# EAGLE design sensor pcb 4 (EAGLE 6.4)
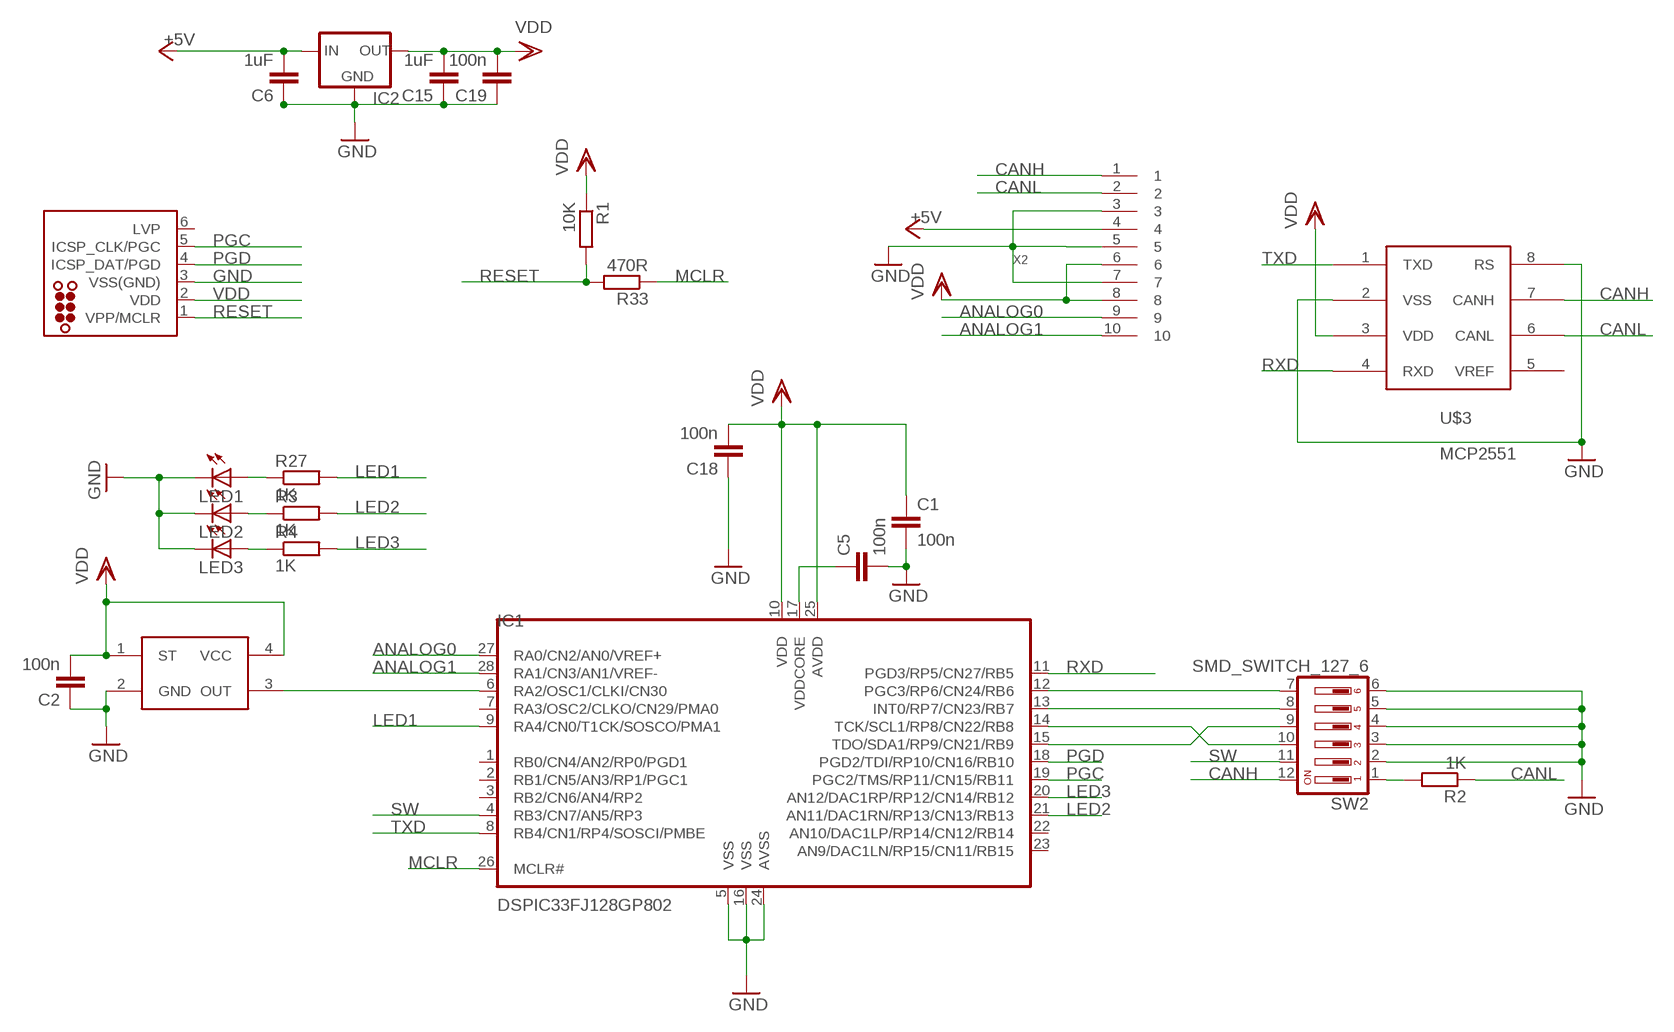
[diagram p0: schematic, sheet 1]

## Parts
C1  100n  C-EUC0402K  [C0402K]
C2  100n  C-EUC0402K  [C0402K]
C5  100n  C-EUC0402K  [C0402K]
C6  1uF  C-EUC0402K  [C0402K]
C15  1uF  C-EUC0402K  [C0402K]
C18  100n  C-EUC0402K  [C0402K]
C19  100n  C-EUC0402K  [C0402K]
IC1  DSPIC33FJ128GP802  [QFN-S28-6X6]
IC2  XC63FPM  [SOT23]
J1  TC2030-MCP-NL  [TC2030-MCP-NL]
LED1  LEDCHIPLED_0603  [CHIPLED_0603]
LED2  LEDCHIPLED_0603  [CHIPLED_0603]
LED3  LEDCHIPLED_0603  [CHIPLED_0603]
R1  10K  R-EU_R0402  [R0402]
R2  1K  R-EU_R0402  [R0402]
R3  1K  R-EU_R0402  [R0402]
R4  1K  R-EU_R0402  [R0402]
R27  1K  R-EU_R0402  [R0402]
R33  470R  R-EU_R0402  [R0402]
SW2  SMD_SWITCH_127_6  [SMD_SWITCH_127_6]
U$1  SG-310  [SG-310]
U$3  MCP2551  [999]
X2  10PINJAS  [10PIN0.1]

## Nets
+5V: C6.2 IC2.3(IN) X2.4
ANALOG0: IC1.27(RA0/CN2/AN0/VREF+) X2.9
ANALOG1: IC1.28(RA1/CN3/AN1/VREF-) X2.10
CANH: SW2.12 U$3.7(CANH) X2.1
CANL: R2.1 U$3.6(CANL) X2.2
GND: C1.2 C2.1 C5.2 C6.1 C15.1 C18.1 C19.1 IC1.5(VSS) IC1.16(VSS) IC1.24(AVSS) IC2.1(GND) J1.3(VSS(GND)) LED1.C LED2.C LED3.C SW2.2 SW2.3 SW2.4 SW2.5 SW2.6 U$1.2(GND) U$3.2(VSS) U$3.8(RS) X2.3 X2.5 X2.7
LED1: IC1.9(RA4/CN0/T1CK/SOSCO/PMA1) R27.2
LED2: IC1.21(AN11/DAC1RN/RP13/CN13/RB13) R3.2
LED3: IC1.20(AN12/DAC1RP/RP12/CN14/RB12) R4.2
MCLR: IC1.26(MCLR#) R33.1
N$1: IC1.12(PGC3/RP6/CN24/RB6) SW2.7
N$2: IC1.13(INT0/RP7/CN23/RB7) SW2.8
N$3: IC1.15(TDO/SDA1/RP9/CN21/RB9) SW2.9
N$4: IC1.14(TCK/SCL1/RP8/CN22/RB8) SW2.10
N$5: IC1.6(RA2/OSC1/CLKI/CN30) U$1.3(OUT)
N$6: C5.1 IC1.17(VDDCORE)
N$8: R2.2 SW2.1
N$9: LED2.A R3.1
N$10: LED3.A R4.1
N$23: LED1.A R27.1
PGC: IC1.19(PGC2/TMS/RP11/CN15/RB11) J1.5(ICSP_CLK/PGC)
PGD: IC1.18(PGD2/TDI/RP10/CN16/RB10) J1.4(ICSP_DAT/PGD)
RESET: J1.1(VPP/MCLR) R1.2 R33.2
RXD: IC1.11(PGD3/RP5/CN27/RB5) U$3.4(RXD)
SW: IC1.4(RB3/CN7/AN5/RP3) SW2.11
TXD: IC1.8(RB4/CN1/RP4/SOSCI/PMBE) U$3.1(TXD)
VDD: C1.1 C2.2 C15.2 C18.2 C19.2 IC1.10(VDD) IC1.25(AVDD) IC2.2(OUT) J1.2(VDD) R1.1 U$1.1(ST) U$1.4(VCC) U$3.3(VDD) X2.6 X2.8
Unconnected: IC1.1(RB0/CN4/AN2/RP0/PGD1) IC1.2(RB1/CN5/AN3/RP1/PGC1) IC1.3(RB2/CN6/AN4/RP2) IC1.7(RA3/OSC2/CLKO/CN29/PMA0) IC1.22(AN10/DAC1LP/RP14/CN12/RB14) IC1.23(AN9/DAC1LN/RP15/CN11/RB15) J1.6(LVP) U$3.5(VREF)

## Library data of the parts
C1 C2 C5 C6 C15 C18 C19 = rcl:C-EU: CAPACITOR, European symbol
IC1 = microchip-dspic:DSPIC33FJ128GP802
IC2 = v-reg:XC63FP: Positiv Voltage Regulators www.torex.co.jp/english/product/pro02/pdf/0201_xc62fp.pdf
J1 = tag-connect:TC2030: TAG-CONNECT ICSP Connector Manufacturer: Tag-Connect <http://www.tag-connect.com> Cable for easy In-Circuit Serial Programming. Designed for Microchip ICD2, suitable for many others. Two variants - one "with legs" (for hands-free fit on PCB) and another "without legs" for quick programming. PAD Description 1 MCLR/Vpp 2 Vdd 3 GND 4 PGD (ISPDAT) 5 PGC (ISPCLK) 6 nc (used for LVP) ©2009 ROFA.cz - modified and updated by Robert Darlington ‹rdarlington@gmail.com›
LED1-LED3 = led:LED: LED OSRAM: - CHIPLED LG R971, LG N971, LY N971, LG Q971, LY Q971, LO R971, LY R971 LH N974, LH R974 LS Q976, LO Q976, LY Q976 LO Q996 - Hyper CHIPLED LW Q18S LB Q993, LB Q99A, LB R99A - SideLED LS A670, LO A670, LY A670, LG A670, LP A670 LB A673, LV A673, LT A673, LW A673 LH A674 LY A675 LS A676, LA A676, LO A676, LY A676, LW A676 LS A679, LY A679, LG A679 - Hyper Micro SIDELED® LS Y876, LA Y876, LO Y876, LY Y876 LT Y87S - SmartLED LW L88C, LW L88S LB L89C, LB L89S, LG L890 LS L89K, LO L89K, LY L89K LS L896, LA L896, LO L896, LY L896 - TOPLED LS T670, LO T670, LY T670, LG T670, LP T670 LSG T670, LSP T670, LSY T670, LOP T670, LYG T670 LG T671, LOG T671, LSG T671 LB T673, LV T673, LT T673, LW T673 LH T674 LS T676, LA T676, LO T676, LY T676, LB T676, LH T676, LSB T676, LW T676 LB T67C, LV T67C, LT T67C, LS T67K, LO T67K, LY T67K, LW E67C LS E67B, LA E67B, LO E67B, LY E67B, LB E67C, LV E67C, LT E67C LW T67C LS T679, LY T679, LG T679 LS T770, LO T770, LY T770, LG T770, LP T770 LB T773, LV T773, LT T773, LW T773 LH T774 LS E675, LA E675, LY E675, LS T675 LS T776, LA T776, LO T776, LY T776, LB T776 LHGB T686 LT T68C, LB T68C - Hyper Mini TOPLED® LB M676 - Mini TOPLED Santana® LG M470 LS M47K, LO M47K, LY M47K Source: http://www.osram.convergy.de LUXEON: - LUMILED® LXK2-PW12-R00, LXK2-PW12-S00, LXK2-PW14-U00, LXK2-PW14-V00 LXK2-PM12-R00, LXK2-PM12-S00, LXK2-PM14-U00 LXK2-PE12-Q00, LXK2-PE12-R00, LXK2-PE12-S00, LXK2-PE14-T00, LXK2-PE14-U00 LXK2-PB12-K00, LXK2-PB12-L00, LXK2-PB12-M00, LXK2-PB14-N00, LXK2-PB14-P00, LXK2-PB14-Q00 LXK2-PR12-L00, LXK2-PR12-M00, LXK2-PR14-Q00, LXK2-PR14-R00 LXK2-PD12-Q00, LXK2-PD12-R00, LXK2-PD12-S00 LXK2-PH12-R00, LXK2-PH12-S00 LXK2-PL12-P00, LXK2-PL12-Q00, LXK2-PL12-R00 Source: www.luxeon.com KINGBRIGHT: KA-3528ASYC Source: www.kingbright.com
R1-R4 R27 R33 = rcl:R-EU_: RESISTOR, European symbol
SW2 = jas new (2):SMD_SWITCH_127_6: Half pitch smd switch Onecall 1605480
U$1 = jas new:SG-310
U$3 = can controller:MCP2551
X2 = jas new:10PINJAS

## Board
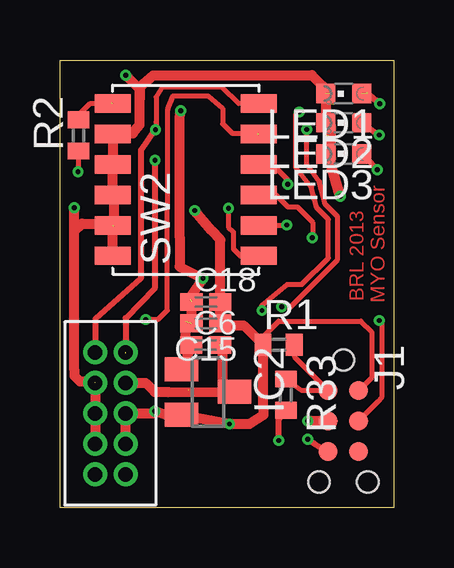
[diagram p1: board, top side]
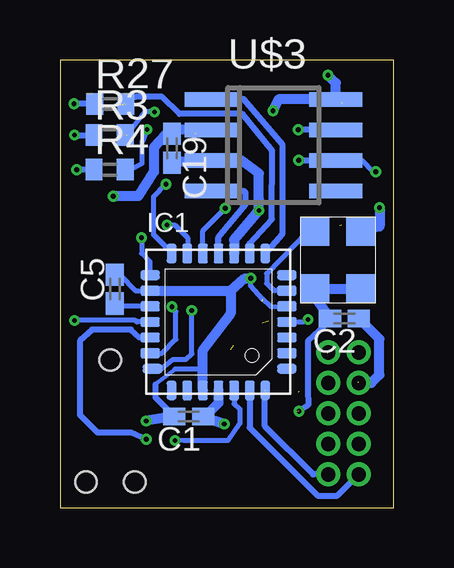
[diagram p2: board, bottom side, seen from below]

Size 13.91 x 18.66 mm. Coordinates in mm from the lower left corner, seen from the top.
Outline: 0,0 0,18.66 13.91,18.66 13.91,0 0,0
Copper layers (1*16): Top 0.035mm / dielectric 1.5mm / Bottom 0.035mm
Design rules: minimum track width 0.125mm, minimum drill 0.2mm, track to track 0.125mm, track to pad 0.125mm, pad to pad 0.125mm, via to via 0.125mm, smd to smd 0.125mm, copper to edge 0.3mm, drill to drill 0.2mm, minimum pad ring 0.2mm, minimum via ring 0.125mm, stop-mask expansion 0.075mm, vias tented up to drill 0.2mm, thermal gap 0.2mm

### Footprints (pad centres in the part's own frame; a part is rotated, then mirrored left to right if it is on the bottom)
C0402K = smd 0.925 x 0.74: 1 -0.6,0; 2 0.6,0
QFN-S28-6X6 = smd 0.813 x 0.406: 1 2.85,-1.95; 2 2.85,-1.3; 3 2.85,-0.65; 4 2.85,0; 5 2.85,0.65; 6 2.85,1.3; 7 2.85,1.95; 15 -2.85,1.95; 16 -2.85,1.3; 17 -2.85,0.65; 18 -2.85,0; 19 -2.85,-0.65; 20 -2.85,-1.3; 21 -2.75,-1.95 | smd 0.406 x 0.813: 8 1.95,2.85; 9 1.3,2.85; 10 0.65,2.85; 11 0,2.85; 12 -0.65,2.85; 13 -1.3,2.85; 14 -1.95,2.85; 22 -1.95,-2.85; 23 -1.3,-2.85; 24 -0.65,-2.85; 25 0,-2.85; 26 0.65,-2.85; 27 1.3,-2.85; 28 1.95,-2.85
SOT23 = smd 1 x 1.4: 1 -0.95,-1.1; 2 0.95,-1.1; 3 0,1.1
TC2030-MCP-NL = smd 0.787 x 0.787: 1 1.27,-0.635; 2 1.27,0.635; 3 2.54,-0.635; 4 2.54,0.635; 5 3.81,-0.635; 6 3.81,0.635 | hole 0.889: 0,0; 5.08,-1.016; 5.08,1.016
CHIPLED_0603 = smd 0.8 x 0.8: A 0,-0.75; C 0,0.75
R0402 = smd 0.7 x 0.9: 1 -0.65,0; 2 0.65,0
SMD_SWITCH_127_6 = smd 0.76 x 1.5: 1 3.81,0; 2 2.54,0; 3 1.27,0; 4 0,0; 5 -1.27,0; 6 -2.54,0; 7 -2.54,-6.096; 8 -1.27,-6.096; 9 0,-6.096; 10 1.27,-6.096; 11 2.54,-6.096; 12 3.81,-6.096
SG-310 = smd 1.2 x 1.2: 1 0,0; 2 2.4,0; 3 2.4,1.9; 4 0,1.9
999 = smd 0.6 x 2.2: 1 -1.905,-2.6; 2 -0.635,-2.6; 3 0.635,-2.6; 4 1.905,-2.6; 5 1.905,2.6; 6 0.635,2.6; 7 -0.635,2.6; 8 -1.905,2.6
10PIN0.1 = drill 0.6: 1 2.54,2.54; 2 2.54,1.27; 3 1.27,2.54; 4 1.27,1.27; 5 0,2.54; 6 0,1.27; 7 -1.27,2.54; 8 -1.27,1.27; 9 -2.54,2.54; 10 -2.54,1.27

### Placement (x,y rotation side)
C1  8.54,3.81 180 bottom
C2  2.05,7.89 180 bottom
C5  11.62,9.11 90 bottom
C6  6.07,6.78 0 top
C15  6.08,7.69 0 top
C18  6.08,8.58 0 top
C19  9.24,14.99 270 bottom
IC1  7.3,7.75 0 bottom
IC2  6.17,4.83 270 top
J1  11.81,6.16 270 top
LED1  11.82,17.26 90 top
LED2  11.82,16.04 90 top
LED3  11.82,14.74 90 top
R1  9.11,6.79 0 top
R2  0.77,15.52 90 top
R3  11.84,15.53 0 bottom
R4  11.84,14.09 0 bottom
R27  11.81,16.83 0 bottom
R33  9.41,4.72 90 top
SW2  2.19,13.04 90 top
U$1  1.38,9.13 90 bottom
U$3  5.02,15.11 270 bottom
X2  4,3.94 90 top

### Tracks (layer width: path | path; a pad name or v marks a point on that pad's centre or on a via)
+5V  (2 unrouted)
  Top 0.254: 4.51,4.83 IC2.3
  Top 0.406: 6.79,6.61 6.78,5.15 IC2.3 4.51,4.83 3.98,4.83 3.97,4.84 | X2.4 3.56,5.21 3.94,4.83
ANALOG0
  Bottom 0.254: IC1.27 6,3.34 3.17,0.51 2.35,0.51 X2.9
ANALOG1  (1 unrouted)
  Bottom 0.254: X2.10 3.36,1.4 5.37,3.41 5.37,4.9 5.31,4.96 5.31,4.85 5.35,4.81
CANH  (via drill 0.2)
  Top 0.2: SW2.12 7.44,16.84 6.74,17.53 4.25,17.52 4,17.12 4,16.07 v3.98,15.75
  Top 0.254: v3.98,15.75 3.94,15.75 3.37,14.91 3.37,9.57 1.47,7.87 1.47,6.55 X2.1
  Bottom 0.254: U$3.7 v3.99,15.75 v3.98,15.75
CANL  (via drill 0.2)  (1 unrouted)
  Top 0.2: R2.1 0.77,14.03 v0.75,14.01
  Top 0.254: v3.96,14.49 3.96,9.18 2.73,7.91 2.74,6.55 2.74,6.44 2.75,6.43
  Bottom 0.2: 2.7,14.48 2.6,14.38 2.44,14.38 2.42,14.41 | 2.42,14.41 2.38,14.45 | 2.42,14.41 U$3.6 1.32,14.48 0.85,14.01 v0.75,14.01
  Bottom 0.254: v3.96,14.49 2.7,14.48
GND  (via drill 0.2)  (6 unrouted)
  Top 0.2: 5.31,6.34 IC2.1 | C6.1 5.17,6.99 5.24,7.01 | 11.27,15.97 11.25,15.99 LED2.C LED3.C 11.22,14.55 | v5.03,16.55 5.04,16.54
  Top 0.406: v10.32,3.62 J1.3 | C6.1 5.31,6.34 | 5.24,7.01 5.24,7.77 | C15.1 5.48,8.85 v5.96,9.57 4.99,10.06 4.99,11.3 4.99,11.75 4.99,16.26 v5.03,16.55 | LED1.C LED2.C | 11.27,15.97 11.27,14.51 | v11.68,12.98 11.22,14.55 | 0.6,11.52 0.6,5.73 0.6,5.5 0.83,5.27 1.44,5.27 1.47,5.24 X2.5 | 0.6,11.52 0.92,11.84 2.12,11.84 SW2.5 | SW2.6 2.19,11.55 1.98,11.76 2.24,11.76 2.26,11.78 2.26,12.97 SW2.4 | SW2.4 2.17,13.06 | SW2.4 SW2.3 SW2.2 3.04,15.6 3.32,15.96 3.32,17.01 | 3.32,17.01 3.32,17.54 | 3.32,17.54 3.88,18.02 10.49,18.03 11.26,17.28 | 0.6,11.52 v0.6,12.49 v0.59,12.5 | 3.32,17.54 3.32,17.01 | 3.32,17.54 3.22,17.54 v2.74,18.02 | X2.5 | X2.5 X2.7
  Bottom 0.18: 9.11,5.78 9.94,5.14
  Bottom 0.2: IC1.24 7.95,5.7 8.03,5.78 9.11,5.78 | C5.2 11.43,9.71 10.76,9.05 IC1.16 | IC1.5 4.47,8.38 5.13,8.39 5.14,8.39 5.45,8.7 5.96,9.26 v5.96,9.56 | 9.08,15.75 C19.1 9.24,15.84
  Bottom 0.254: 9.94,5.14 9.94,4.61 C1.2 | 1.49,17.02 U$3.8
  Bottom 0.406: C1.2 v10.32,3.62 | IC1.24 7.95,6.56 6.79,8.1 6.79,9.05 | IC1.16 6.79,9.05 | 6.79,9.05 6.21,9.57 v5.96,9.57 | U$3.2 9.08,15.75 | 9.24,15.84 9.99,15.01 9.99,13.99 10.64,12.99 v11.68,12.98 | v0.59,12.5 0.59,11.73 U$1.2 | v5.03,16.55 4.81,17.02 U$3.8 2.42,17.7 | 2.42,17.7 v2.74,18.02 2.42,17.7 | X2.3 0.93,5.21 0.6,5.54 0.6,7.04 C2.1
LED1  (1 unrouted)
  Bottom 0.254: IC1.9 6,11.02 5.08,12.03 5.07,14.88 6.31,16.41 8.92,16.41 9.65,17.12 10.76,17.12 11.06,17.11 11.41,16.8 11.42,16.8 11.45,16.8 11.46,16.81
LED2  (via drill 0.2)  (1 unrouted)
  Top 0.2: v8.41,8.22 8.41,8.44 9.47,9.31 10.08,9.31 11.18,10.41 11.18,12.02 11.09,12.11 10.7,12.5 10.48,13.36 9.83,14.17 9.83,16.41 v9.97,16.5
  Bottom 0.2: 10,5.75 IC1.21 9.7,5.8 9.21,6.19 8.67,6.19 8.41,6.41 v8.41,8.22 | v9.97,16.5 10.37,16.5 10.73,16.05 11.12,15.49 11.46,15.49
LED3  (via drill 0.2)
  Top 0.2: v9.24,8.38 9.24,8.37 9.62,8.37 10.78,9.55 11.57,10.34 11.57,12.14 11.05,12.66 10.81,13.6 10.28,14.32 v10.28,15.77
  Bottom 0.2: IC1.20 9.65,6.45 9.08,7.02 9.08,8.19 v9.24,8.38 | v10.28,15.77 10.5,15.23 10.49,14.34 11.01,14.07 R4.2
MCLR  (via drill 0.2)
  Top 0.254: v9.11,2.81 9.12,3.69 R33.1
  Bottom 0.2: IC1.26 6.65,4.33 6.41,4.13 6.41,3.52 6.91,2.8 8.75,2.8 v9.11,2.81
N$1  (via drill 0.2)
  Top 0.2: v7.02,12.48 7.02,11.7 7.22,11.5 7.22,10.79 7.51,10.5 SW2.7
  Bottom 0.2: IC1.12 7.95,11.55 v7.02,12.48
N$2  (via drill 0.2)
  Top 0.2: SW2.8 9.36,11.77 v9.45,11.79
  Bottom 0.2: v9.45,11.79 9.13,11.79 8.59,11.25 IC1.13
N$3  (via drill 0.2)
  Top 0.2: SW2.9 8.99,13.04 9.49,12.54 9.89,12.54 10.53,11.9 10.53,11.27 v10.51,11.25
  Bottom 0.2: v10.51,11.25 10.51,10.6 10.16,10.25 IC1.15
N$4  (via drill 0.2)
  Top 0.2: v9.49,13.49 9.49,13.67 8.89,14.27 8.33,14.27 SW2.10
  Bottom 0.2: IC1.14 9.25,10.63 10.01,11.39 10.01,12.97 v9.49,13.49
N$5
  Bottom 0.2: U$1.3 3.58,11.53 5.3,9.76 5.3,9.35 5.01,9.06 4.46,9.06 IC1.6
N$6
  Bottom 0.2: IC1.17 11.51,8.4 C5.1
N$8  (1 unrouted)
  Top 0.2: R2.2 0.77,16.35 1.27,16.85 2.12,16.85 2.16,16.89 2.22,16.89 2.32,16.79 2.26,16.79 2.22,16.83
N$9  (via drill 0.2)
  Top 0.254: LED2.A v13.3,15.53
  Bottom 0.254: v13.3,15.53 R3.1
N$10  (via drill 0.2)
  Top 0.254: v13.21,14.09 12.75,14.57 LED3.A
  Bottom 0.254: R4.1 v13.21,14.09
N$23  (via drill 0.2)  (1 unrouted)
  Top 0.254: v13.32,16.83 12.79,17.27 12.79,17.24
  Bottom 0.254: R27.1 v13.32,16.83
PGC  (via drill 0.2)
  Top 0.2: 11.11,2.35 J1.5
  Top 0.254: v10.32,2.86 10.57,2.7 11.11,2.35
  Bottom 0.254: IC1.19 10.59,7.1 10.95,7.43 12.57,7.43 13.08,6.95 13.08,3.87 12.35,3.14 10.95,3.14 v10.32,2.86
PGD  (via drill 0.2)
  Top 0.2: v13.3,7.81 13.4,7.75 13.4,4.6 13.24,4.41 J1.4
  Bottom 0.2: IC1.18 10.7,7.75 10.76,7.81 v13.3,7.81
RESET
  Top 0.2: R1.2 9.76,6.3 J1.1 10.08,4.89 R33.2
RXD
  Bottom 0.254: IC1.11 7.3,11.16 7.3,11.27 6.17,12.65 6.17,13.13 6.24,13.2 U$3.4
SW  (via drill 0.2)  (1 unrouted)
  Top 0.2: v3.57,7.85 4.09,7.85 4.47,8.23 4.49,16.6 4.71,17.17 6.17,17.17 6.78,16.65 6.78,16 7.18,15.6 8.45,15.6 8.46,15.59 8.48,15.59 8.24,15.59 8.22,15.57
  Bottom 0.2: IC1.4 3.77,7.75 v3.57,7.85
TXD
  Bottom 0.254: IC1.8 5.35,10.59 4.64,11.43 4.64,15.13 6.26,17.03 U$3.1
VDD  (via drill 0.2)  (1 unrouted)
  Top 0.2: C15.2 6.69,7.75 | 7.08,3.5 7.9,3.5 | 8.48,6.78 R1.1 8.46,7.13 9.11,7.78 12.54,7.78 12.99,7.33 12.99,5.43 J1.2
  Top 0.254: 4.76,3.76 IC2.2 | v3.95,4.03 v3.96,4.03 3.98,4.06
  Top 0.406: 4.03,4 4.76,3.76 | v7.06,3.5 7.9,3.5 8.48,3.88 8.48,4.6 8.48,6.78 | C15.2 C18.2 6.68,11.16 6.32,11.55 v5.62,12.39 | 6.69,7.75 6.75,7.6 7.65,7.61 R1.1 | IC2.2 7.08,3.5 | X2.8 X2.6 3.86,3.94 v3.95,4.03
  Bottom 0.2: 7.91,3.78 C1.1 7.23,3.56 v7.06,3.5 | 9.21,14.41 C19.2
  Bottom 0.254: 7.65,14.48 7.71,14.41 | C2.2 2.66,7.8 3.57,6.95 3.57,4.93 3.57,4.28 v3.95,4.03
  Bottom 0.406: 7.65,14.48 U$3.3 6.35,14.48 5.62,13.94 5.62,12.86 v5.62,12.39 6.65,11.17 IC1.10 | IC1.25 7.3,4.36 7.91,3.78 v7.06,3.5 | 7.71,14.41 9.21,14.41 | C2.2 3.19,8.65 U$1.4 U$1.1

### Text on the board
Top: MYO Sensor | BRL 2013